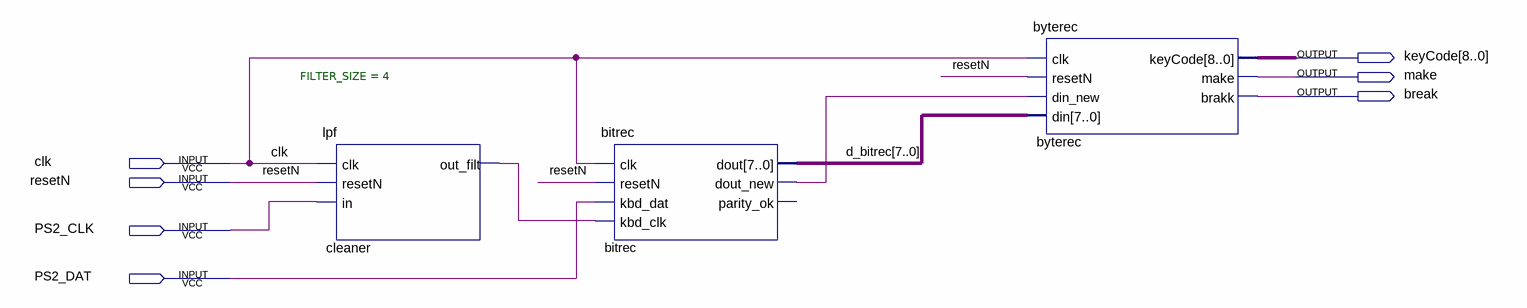
[diagram p0: schematic sheet]
// Quartus schematic KBDINTF.bdf as structural Verilog: 3 symbols, 7 pins
module KBDINTF (
  input  clk,
  input  resetN,
  input  PS2_CLK,
  input  PS2_DAT,
  output [8:0] keyCode,
  output make,
  output \break 
);

  wire bitrec_dout_new, cleaner_out_filt;
  wire [7:0] d_bitrec;

  lpf #(.FILTER_SIZE(4)) cleaner (.clk(clk), .resetN(resetN), .in(PS2_CLK), .out_filt(cleaner_out_filt));
  bitrec bitrec (
    .clk(clk), .resetN(resetN), .kbd_dat(PS2_DAT), .kbd_clk(cleaner_out_filt), .dout(d_bitrec),
    .dout_new(bitrec_dout_new));  // open: parity_ok
  byterec byterec (
    .clk(clk), .resetN(resetN), .din_new(bitrec_dout_new), .din(d_bitrec), .keyCode(keyCode), .make(make),
    .brakk(\break ));
endmodule
